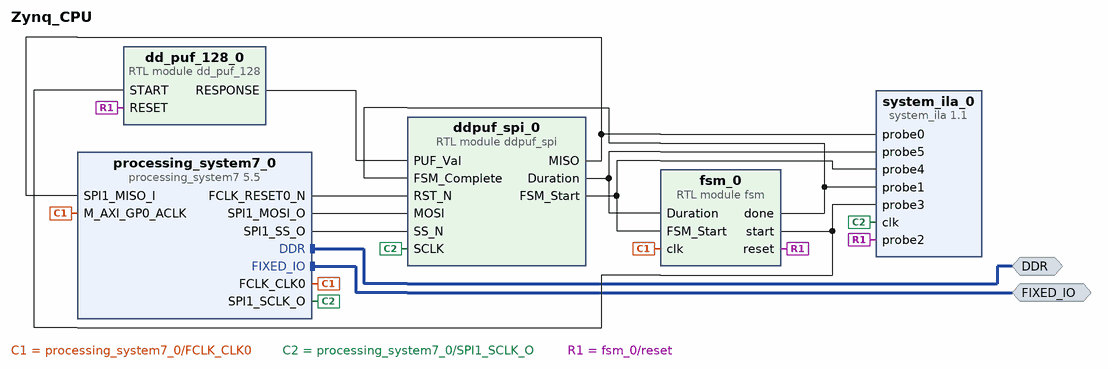
[diagram p0: block diagram of the top level]
# Vivado block design Zynq_CPU, xc7z020clg400-1, Vivado 2021.2
create_bd_design Zynq_CPU

create_bd_intf_port -mode Master -vlnv xilinx.com:interface:ddrx_rtl:1.0 DDR
create_bd_intf_port -mode Master -vlnv xilinx.com:display_processing_system7:fixedio_rtl:1.0 FIXED_IO

create_bd_cell -type ip -vlnv xilinx.com:ip:processing_system7:5.5 processing_system7_0
set_property -dict [list \
  CONFIG.PCW_APU_PERIPHERAL_FREQMHZ 650 \
  CONFIG.PCW_CRYSTAL_PERIPHERAL_FREQMHZ 50 \
  CONFIG.PCW_ENET0_ENET0_IO {MIO 16 .. 27} \
  CONFIG.PCW_ENET0_GRP_MDIO_ENABLE 1 \
  CONFIG.PCW_ENET0_GRP_MDIO_IO {MIO 52 .. 53} \
  CONFIG.PCW_ENET0_PERIPHERAL_ENABLE 1 \
  CONFIG.PCW_ENET0_RESET_ENABLE 1 \
  CONFIG.PCW_ENET0_RESET_IO {MIO 9} \
  CONFIG.PCW_ENET_RESET_ENABLE 1 \
  CONFIG.PCW_ENET_RESET_SELECT {Share reset pin} \
  CONFIG.PCW_FPGA0_PERIPHERAL_FREQMHZ 100 \
  CONFIG.PCW_FPGA1_PERIPHERAL_FREQMHZ 50 \
  CONFIG.PCW_GPIO_MIO_GPIO_ENABLE 1 \
  CONFIG.PCW_GPIO_MIO_GPIO_IO MIO \
  CONFIG.PCW_I2C_RESET_ENABLE 1 \
  CONFIG.PCW_M_AXI_GP0_FREQMHZ 10 \
  CONFIG.PCW_PERIPHERAL_BOARD_PRESET part0 \
  CONFIG.PCW_PRESET_BANK1_VOLTAGE {LVCMOS 1.8V} \
  CONFIG.PCW_QSPI_GRP_FBCLK_ENABLE 1 \
  CONFIG.PCW_QSPI_GRP_FBCLK_IO {MIO 8} \
  CONFIG.PCW_QSPI_GRP_SINGLE_SS_ENABLE 1 \
  CONFIG.PCW_QSPI_GRP_SINGLE_SS_IO {MIO 1 .. 6} \
  CONFIG.PCW_QSPI_PERIPHERAL_ENABLE 1 \
  CONFIG.PCW_QSPI_QSPI_IO {MIO 1 .. 6} \
  CONFIG.PCW_SD0_GRP_CD_ENABLE 1 \
  CONFIG.PCW_SD0_GRP_CD_IO {MIO 47} \
  CONFIG.PCW_SD0_GRP_WP_ENABLE 0 \
  CONFIG.PCW_SD0_PERIPHERAL_ENABLE 1 \
  CONFIG.PCW_SD0_SD0_IO {MIO 40 .. 45} \
  CONFIG.PCW_SDIO_PERIPHERAL_FREQMHZ 50 \
  CONFIG.PCW_SINGLE_QSPI_DATA_MODE x4 \
  CONFIG.PCW_SPI1_PERIPHERAL_ENABLE 1 \
  CONFIG.PCW_SPI1_SPI1_IO EMIO \
  CONFIG.PCW_UART0_PERIPHERAL_ENABLE 1 \
  CONFIG.PCW_UART0_UART0_IO {MIO 14 .. 15} \
  CONFIG.PCW_UART1_PERIPHERAL_ENABLE 0 \
  CONFIG.PCW_UART_PERIPHERAL_FREQMHZ 100 \
  CONFIG.PCW_UIPARAM_DDR_BUS_WIDTH {16 Bit} \
  CONFIG.PCW_UIPARAM_DDR_FREQ_MHZ 525 \
  CONFIG.PCW_UIPARAM_DDR_PARTNO {MT41J256M16 RE-125} \
  CONFIG.PCW_USB0_PERIPHERAL_ENABLE 1 \
  CONFIG.PCW_USB0_RESET_ENABLE 1 \
  CONFIG.PCW_USB0_RESET_IO {MIO 46} \
  CONFIG.PCW_USB0_USB0_IO {MIO 28 .. 39} \
  CONFIG.PCW_USB_RESET_ENABLE 1 \
  CONFIG.PCW_USB_RESET_SELECT {Share reset pin} \
] [get_bd_cells processing_system7_0]
# 488 more settings of processing_system7_0 are not shown: defaults, MIO pin electricals, DDR timing, and values the tool derives
create_bd_cell -type ip -vlnv xilinx.com:ip:system_ila:1.1 system_ila_0
set_property -dict [list \
  CONFIG.C_MON_TYPE NATIVE \
  CONFIG.C_NUM_OF_PROBES 6 \
  CONFIG.C_PROBE0_TYPE 0 \
  CONFIG.C_PROBE1_TYPE 0 \
  CONFIG.C_PROBE2_TYPE 0 \
  CONFIG.C_PROBE3_TYPE 0 \
] [get_bd_cells system_ila_0]
create_bd_cell -type module -reference fsm fsm_0
create_bd_cell -type module -reference dd_puf_128 dd_puf_128_0
create_bd_cell -type module -reference ddpuf_spi ddpuf_spi_0

# ---- connections ----

connect_bd_intf_net [get_bd_intf_ports DDR] [get_bd_intf_pins processing_system7_0/DDR]
connect_bd_intf_net [get_bd_intf_ports FIXED_IO] [get_bd_intf_pins processing_system7_0/FIXED_IO]
connect_bd_net -net Duration [get_bd_pins ddpuf_spi_0/Duration] [get_bd_pins fsm_0/Duration] [get_bd_pins system_ila_0/probe5]
connect_bd_net -net FSM_Start [get_bd_pins ddpuf_spi_0/FSM_Start] [get_bd_pins fsm_0/FSM_Start] [get_bd_pins system_ila_0/probe4]
connect_bd_net [get_bd_pins dd_puf_128_0/RESPONSE] [get_bd_pins ddpuf_spi_0/PUF_Val]
connect_bd_net -net ddpuf_spi_0_MISO [get_bd_pins ddpuf_spi_0/MISO] [get_bd_pins processing_system7_0/SPI1_MISO_I] [get_bd_pins system_ila_0/probe0]
connect_bd_net -net fsm_0_done [get_bd_pins fsm_0/done] [get_bd_pins system_ila_0/probe1] [get_bd_pins ddpuf_spi_0/FSM_Complete]
connect_bd_net [get_bd_pins processing_system7_0/FCLK_CLK0] [get_bd_pins processing_system7_0/M_AXI_GP0_ACLK] [get_bd_pins fsm_0/clk]
connect_bd_net [get_bd_pins processing_system7_0/FCLK_RESET0_N] [get_bd_pins ddpuf_spi_0/RST_N]
connect_bd_net [get_bd_pins processing_system7_0/SPI1_MOSI_O] [get_bd_pins ddpuf_spi_0/MOSI]
connect_bd_net [get_bd_pins processing_system7_0/SPI1_SCLK_O] [get_bd_pins system_ila_0/clk] [get_bd_pins ddpuf_spi_0/SCLK]
connect_bd_net [get_bd_pins processing_system7_0/SPI1_SS_O] [get_bd_pins ddpuf_spi_0/SS_N]
connect_bd_net -net reset [get_bd_pins fsm_0/reset] [get_bd_pins system_ila_0/probe2] [get_bd_pins dd_puf_128_0/RESET]
connect_bd_net -net start [get_bd_pins fsm_0/start] [get_bd_pins system_ila_0/probe3] [get_bd_pins dd_puf_128_0/START]
set_property HDL_ATTRIBUTE.DEBUG true [get_bd_nets Duration]
set_property HDL_ATTRIBUTE.MARK_DEBUG true [get_bd_nets Duration]
set_property HDL_ATTRIBUTE.DEBUG true [get_bd_nets FSM_Start]
set_property HDL_ATTRIBUTE.MARK_DEBUG true [get_bd_nets FSM_Start]
set_property HDL_ATTRIBUTE.DEBUG true [get_bd_nets ddpuf_spi_0_MISO]
set_property HDL_ATTRIBUTE.MARK_DEBUG true [get_bd_nets ddpuf_spi_0_MISO]
set_property HDL_ATTRIBUTE.DEBUG true [get_bd_nets fsm_0_done]
set_property HDL_ATTRIBUTE.MARK_DEBUG true [get_bd_nets fsm_0_done]
set_property HDL_ATTRIBUTE.DEBUG true [get_bd_nets reset]
set_property HDL_ATTRIBUTE.MARK_DEBUG true [get_bd_nets reset]
set_property HDL_ATTRIBUTE.DEBUG true [get_bd_nets start]
set_property HDL_ATTRIBUTE.MARK_DEBUG true [get_bd_nets start]

validate_bd_design
save_bd_design
